# Altium project uz_per_combine_rj45_bnc.PrjPcb
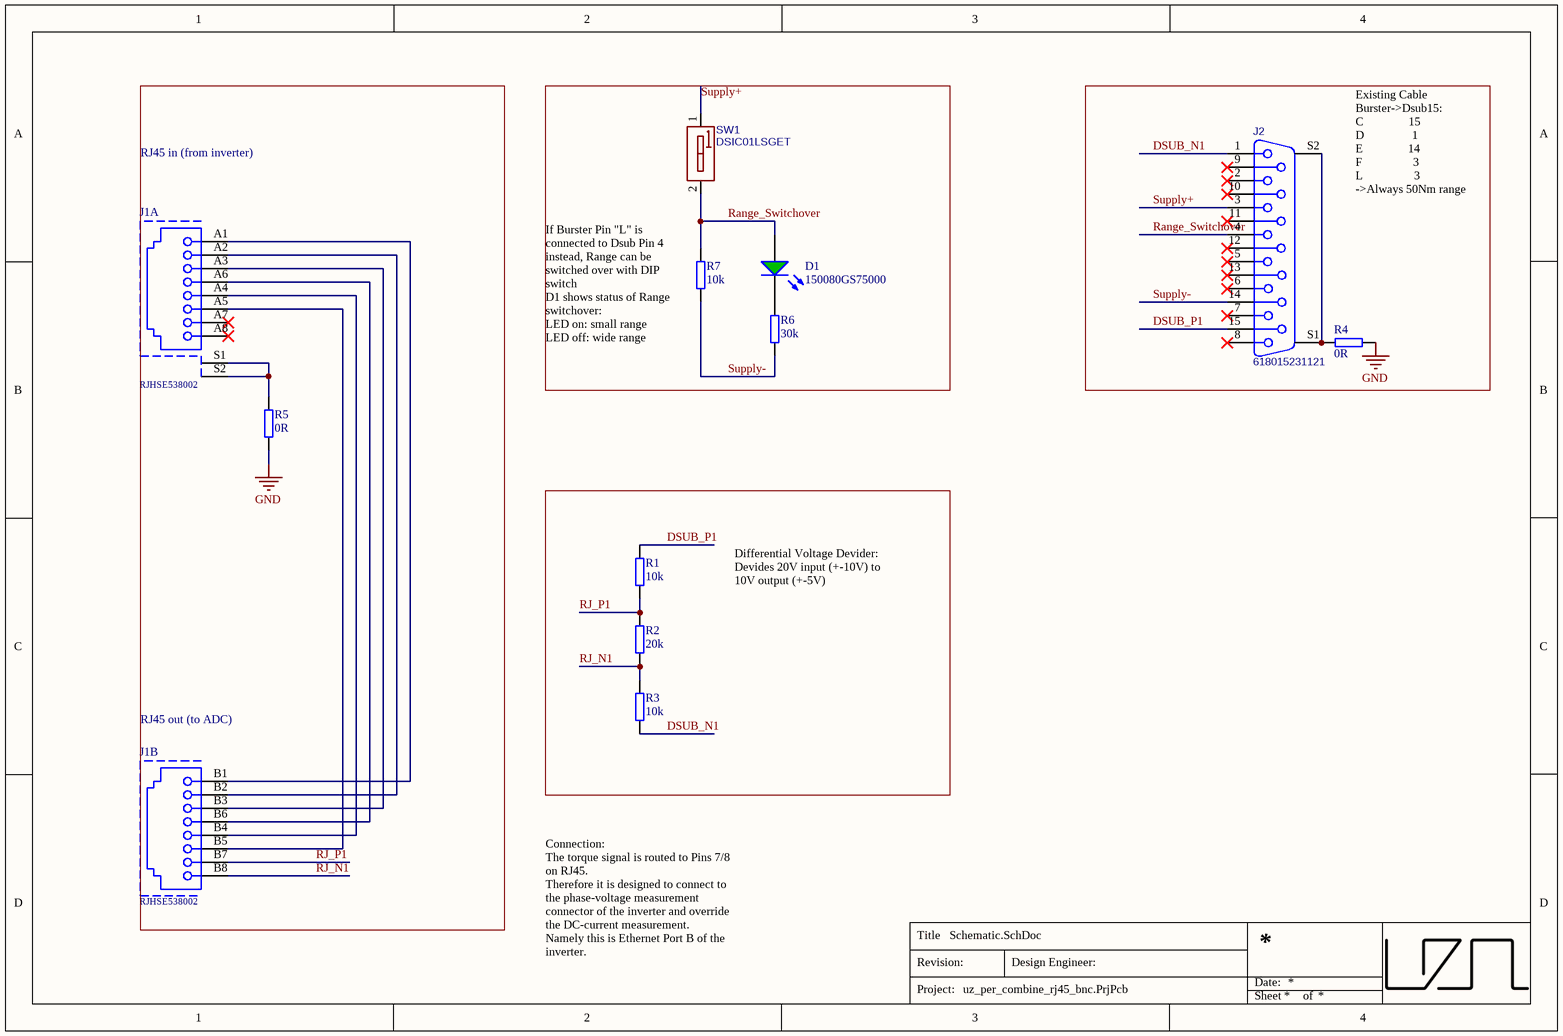
[diagram p0: Schematic.SchDoc]
1 sheet, 11 parts. Net scope: global (net labels, ports and power ports of the same name join across sheets).
Board file: PCB1.PcbDoc

## Sheet Schematic.SchDoc
size A4; Author: Valentin Hoppe; Revision: 0.1

### Parts
D1  150080GS75000  [LEDM2012X80N]
J1  RJHSE538002  [RJHSE-5380-02]  (parts A,B of 2)
J2  618015231121  [PCB - MISC - DSUB15]
R1  10k  [RES 0805_2012]
R2  20k  [RES 0805_2012]
R3  10k  [RES 0805_2012]
R4  0R  [RES 0805_2012]
R5  0R  [RES 0805_2012]
R6  30k  [RES 0805_2012]
R7  10k  [RES 0805_2012]
SW1  DSIC01LSGET  [SW-SMD_DSIC01LSGET]

### Nets
GND: R4.2 R5.1
DSUB_N1: J2.1 R3.1
DSUB_P1: J2.15 R1.2
Range_Switchover: D1.2(A) J2.4 R7.2 SW1.2(A2)
RJ_N1: J1.B8 R2.1 R3.2
RJ_P1: J1.B7 R1.1 R2.2
Supply+: J2.3 SW1.1(A1)
Supply-: J2.14 R6.1 R7.1
NetD1_1: D1.1(K) R6.2
NetJ1_A1: J1.A1 J1.B1
NetJ1_A2: J1.A2 J1.B2
NetJ1_A3: J1.A3 J1.B3
NetJ1_A4: J1.A4 J1.B4
NetJ1_A5: J1.A5 J1.B5
NetJ1_A6: J1.A6 J1.B6
NetJ1_S1: J1.S1 J1.S2 R5.2
NetJ2_S1: J2.S1(MH1) J2.S2(MH2) R4.1

Not connected (* = marked no-connect by the designer): J1 A7* A8*; J2 2* 5* 6* 7* 8* 9* 10* 11* 12* 13*

### Notes on the sheet
- RJ45 in (from inverter)
- Existing Cable
  Burster->Dsub15:
  C               15
  D                1
  E               14
  F                 3
  L                 3
  ->Always 50Nm range
- (near R7) If Burster Pin "L" is connected to Dsub Pin 4 instead, Range can be switched over with DIP switch
  D1 shows status of Range switchover:
  LED on: small range
  LED off: wide range
- Differential Voltage Devider:
  Devides 20V input (+-10V) to 10V output (+-5V)
- RJ45 out (to ADC)
- Connection:
  The torque signal is routed to Pins 7/8 on RJ45.
  Therefore it is designed to connect to the phase-voltage measurement connector of the inverter and override the DC-current measurement.
  Namely this is Ethernet Port B of the inverter.
- Title
- Revision:
- Design Engineer:
- Date:
- Project:
- Sheet
- of

### Library data of the parts
D1 = 150080GS75000: WL-SMCW SMD Mono-color Chip LED Waterclear Green 0805; Manufacturer: Wuerth Elektronik; Type: Standard; Created from: MGremer; Forward Current I_f: 20 mA; Forward Voltage U_f: 3.2 V; Wavelength: 520 nm; Light Intensity: 450 mcd; Nominal Power: 105 mW; Manufacturer Part Number: 150080GS75000; PartID: 11; Created On: 08.12.2020 10:52:57; ComponentLink1Description: Datasheet; ComponentLink1URL: https://www.mouser.de/datasheet/2/445/150080GS75000-1715657.pdf; Component Type: LED Diode; Device Package: 0805; Last Updated: 03.11.2021 10:28:04; Mounting Type: SMD; Operating Temperature: -40 - 85 °C; Supplier 1: Mouser; Supplier Part Number 1: 710-150080GS75000; Live Cycle Status: 1; Stock number: not stored; Color: green; LCSC Part Number: C2297
J1 = RJHSE538002: CAT5, RJ45 Connector, 1x2; Manufacturer: Amphenol; Created from: MGremer; Manufacturer Part Number: RJHSE538002; PartID: 4; Created On: 22.02.2021 16:43:38; ComponentLink1Description: Datasheet; ComponentLink1URL: https://www.farnell.com/cad/2360382.pdf; Component Type: RJ45 Connector; Device Package: RJ45; Last Updated: 22.02.2021 16:43:38; Mounting Type: THT; Series: RJHSE; Supplier 1: Farnell; Supplier Part Number 1: 1860605; Type: RJ45 Connector; Live Cycle Status: 1; Stock number: not stored
J2 = SUB-DRBF-607A-002: 15 Female D-Sub Shrouded 2 3A -40℃~+85℃ Plugin D-Sub/DVI/HDMI Connectors ROHS; BOM_Manufacturer: Würth Elektronik; Manufacturer: Nextron(Nextronics Engineering); Created from: NDiringer; BOM_Supplier: LCSC; BOM_Manufacturer Part: 618015231121; BOM_JLCPCB Part Class: Extended Part; spicePre: D; spiceSymbolName: SUB-DRBF-607A-002; Manufacturer Part Number: 618015231121; PartID: 7; Created On: 17.03.2023 15:40:49; ComponentLink1Description: Datasheet; ComponentLink1URL: https://jlcpcb.com/partdetail/3039947-SUB_DRBF_607A002/C2846090; Component Type: DSUB 15 pole female; Device Package: THT; Last Updated: 04.05.2023 15:17:49; Mounting Type: SMD; Operating Temperature: -40℃~+85℃; Supplier 1: LCSC; Supplier Part Number 1: C2846090; Type: DSUB 15 pole; Live Cycle Status: 1; LCSC Part Number: C2846090; Stock number: not stored
R1-R3 = ERJ-6ENF1182V: SMD resistor 1%; Manufacturer: Panasonic; Tolerance: 0.1%; Created from: MGremer; Manufacturer Part Number: ERJ-6ENF1182V; PartID: 148; Created On: 14.12.2020 16:17:14; ComponentLink1Description: Datasheet; ComponentLink1URL: https://www.mouser.de/datasheet/2/315/AOA0000C304-1149620.pdf; Component Type: SMD resistor; Device Package: 0805; Last Updated: 14.12.2020 18:22:52; Mounting Type: SMD; Supplier 1: Mouser; Supplier Part Number 1: 667-ERJ-6ENF1182V; Type: Resistor; Live Cycle Status: 1; Stock number: not stored
  R1 R3: Value: 10k
  R2: Value: 20k
R4 R5 = ERJ-6ENF1182V: SMD resistor 1%; Manufacturer: Panasonic; Value: 0; Created from: MGremer; Manufacturer Part Number: ERJ-6ENF1182V; PartID: 148; Created On: 14.12.2020 16:17:14; ComponentLink1Description: Datasheet; ComponentLink1URL: https://www.mouser.de/datasheet/2/315/AOA0000C304-1149620.pdf; Component Type: SMD resistor; Device Package: 0805; Last Updated: 14.12.2020 18:22:52; Mounting Type: SMD; Supplier 1: Mouser; Supplier Part Number 1: 667-ERJ-6ENF1182V; Type: Resistor; Tolerance: 1%; Live Cycle Status: 1; Stock number: not stored
R6 R7 = ERJ-6ENF1182V: SMD resistor 1%; Manufacturer: Panasonic; Created from: MGremer; Manufacturer Part Number: ERJ-6ENF1182V; PartID: 148; Created On: 14.12.2020 16:17:14; ComponentLink1Description: Datasheet; ComponentLink1URL: https://www.mouser.de/datasheet/2/315/AOA0000C304-1149620.pdf; Component Type: SMD resistor; Device Package: 0805; Last Updated: 14.12.2020 18:22:52; Mounting Type: SMD; Supplier 1: Mouser; Supplier Part Number 1: 667-ERJ-6ENF1182V; Type: Resistor; Tolerance: 1%; Live Cycle Status: 1; Stock number: not stored
  R6: Value: 30k
  R7: Value: 10k
SW1 = DSIC01LSGET: SPST Black Flat dial, raised type 2.54mm 1 SMD DIP Switches; BOM_Manufacturer: YE; Manufacturer: Dongguan Guangzhu Industrial; Created from: NDiringer; BOM_Supplier: LCSC; BOM_Manufacturer Part: DSIC01LSGET; BOM_Supplier Part: C54948; BOM_JLCPCB Part Class: Extended Part; spicePre: S; spiceSymbolName: DSIC01LSGET; Manufacturer Part Number: DSIC01LSGET; PartID: 19; Created On: 27.02.2023 10:43:27; ComponentLink1Description: Datasheet; ComponentLink1URL: https://jlcpcb.com/parts/2nd/Key_Switch/DIP_Switches_3724; Component Type: DIP-Switch; 1p; Device Package: SMD,2.5x6mm; Last Updated: 27.02.2023 10:43:27; Mounting Type: SMD; Operating Temperature: -40 - 85 °C; Supplier 1: LCSC; Supplier Part Number 1: C54948; Type: Dip Switch 1p; Live Cycle Status: 1